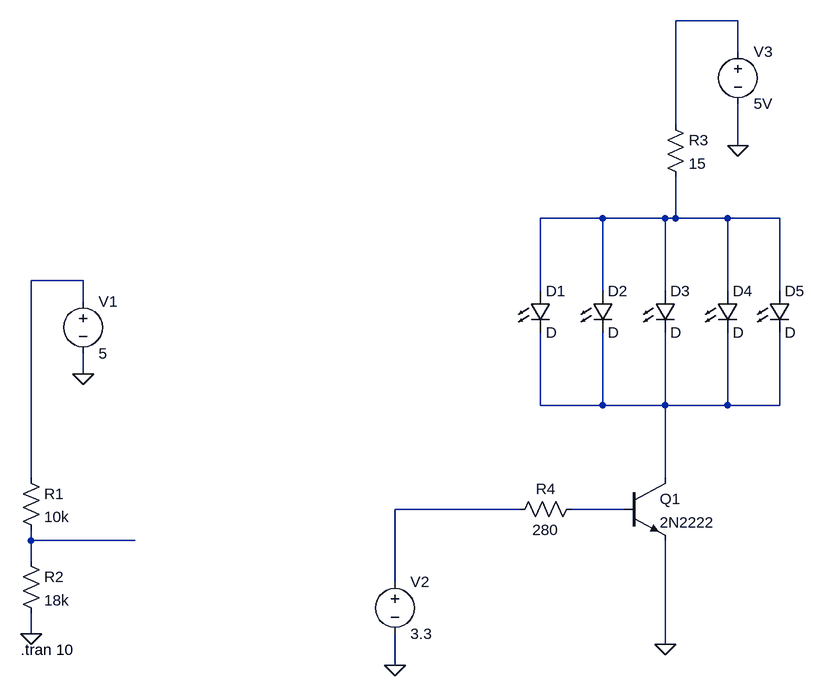
[diagram p0: schematic LED_Circuit.asc]
LED_Circuit.asc, the LTspice schematic file:
Version 4
SHEET 1 1324 680
WIRE 1200 -656 1104 -656
WIRE 1200 -608 1200 -656
WIRE 1104 -496 1104 -656
WIRE 1200 -464 1200 -528
WIRE 992 -352 896 -352
WIRE 1088 -352 992 -352
WIRE 1104 -352 1104 -416
WIRE 1104 -352 1088 -352
WIRE 1184 -352 1104 -352
WIRE 1264 -352 1184 -352
WIRE 192 -256 112 -256
WIRE 896 -240 896 -352
WIRE 992 -240 992 -352
WIRE 1088 -240 1088 -352
WIRE 1184 -240 1184 -352
WIRE 1264 -240 1264 -352
WIRE 192 -224 192 -256
WIRE 192 -112 192 -144
WIRE 896 -64 896 -176
WIRE 992 -64 992 -176
WIRE 992 -64 896 -64
WIRE 1088 -64 1088 -176
WIRE 1088 -64 992 -64
WIRE 1184 -64 1184 -176
WIRE 1184 -64 1088 -64
WIRE 1264 -64 1264 -176
WIRE 1264 -64 1184 -64
WIRE 112 48 112 -256
WIRE 1088 48 1088 -64
WIRE 864 96 672 96
WIRE 1024 96 944 96
WIRE 112 144 112 128
WIRE 272 144 112 144
WIRE 112 176 112 144
WIRE 672 208 672 96
WIRE 112 288 112 256
WIRE 1088 304 1088 144
WIRE 672 336 672 288
FLAG 112 288 0
FLAG 192 -112 0
FLAG 672 336 0
FLAG 1200 -464 0
FLAG 1088 304 0
SYMBOL res 96 32 R0
SYMATTR InstName R1
SYMATTR Value 10k
SYMBOL res 96 160 R0
SYMATTR InstName R2
SYMATTR Value 18k
SYMBOL voltage 192 -240 R0
WINDOW 123 0 0 Left 0
WINDOW 39 0 0 Left 0
SYMATTR InstName V1
SYMATTR Value 5
SYMBOL LED 880 -240 R0
SYMATTR InstName D1
SYMBOL LED 976 -240 R0
SYMATTR InstName D2
SYMBOL LED 1072 -240 R0
SYMATTR InstName D3
SYMBOL LED 1168 -240 R0
SYMATTR InstName D4
SYMBOL LED 1248 -240 R0
SYMATTR InstName D5
SYMBOL res 1088 -512 R0
SYMATTR InstName R3
SYMATTR Value 15
SYMBOL npn 1024 48 R0
SYMATTR InstName Q1
SYMATTR Value 2N2222
SYMBOL res 960 80 R90
WINDOW 0 0 56 VBottom 2
WINDOW 3 32 56 VTop 2
SYMATTR InstName R4
SYMATTR Value 280
SYMBOL voltage 672 192 R0
WINDOW 123 0 0 Left 0
WINDOW 39 0 0 Left 0
SYMATTR InstName V2
SYMATTR Value 3.3
SYMBOL voltage 1200 -624 R0
WINDOW 123 0 0 Left 0
WINDOW 39 0 0 Left 0
SYMATTR InstName V3
SYMATTR Value 5V
TEXT 96 312 Left 2 !.tran 10

The netlist it stands for:
* LED_Circuit.asc
R1 N003 N007 10k
R2 N007 0 18k
V1 N003 0 5
D1 N002 N004 D
D2 N002 N004 D
D3 N002 N004 D
D4 N002 N004 D
D5 N002 N004 D
R3 N001 N002 15
Q1 N004 N006 0 0 2N2222
R4 N006 N005 280
V2 N005 0 3.3
V3 N001 0 5V
.model D D
.lib standard.dio
.model NPN NPN
.model PNP PNP
.lib standard.bjt
.tran 10
.backanno
.end